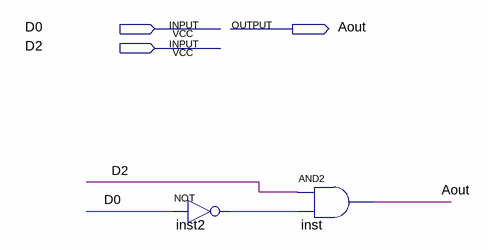
[diagram p0: schematic sheet]
// Quartus schematic A-Logic.bdf as structural Verilog: 2 symbols, 3 pins
module \A-Logic  (
  input  D0,
  input  D2,
  output Aout
);

  wire inst2_out;

  not inst2 (inst2_out, D0);
  and inst (Aout, D2, inst2_out);
endmodule
